# EAGLE design rda5708m (EAGLE 8.0.1)
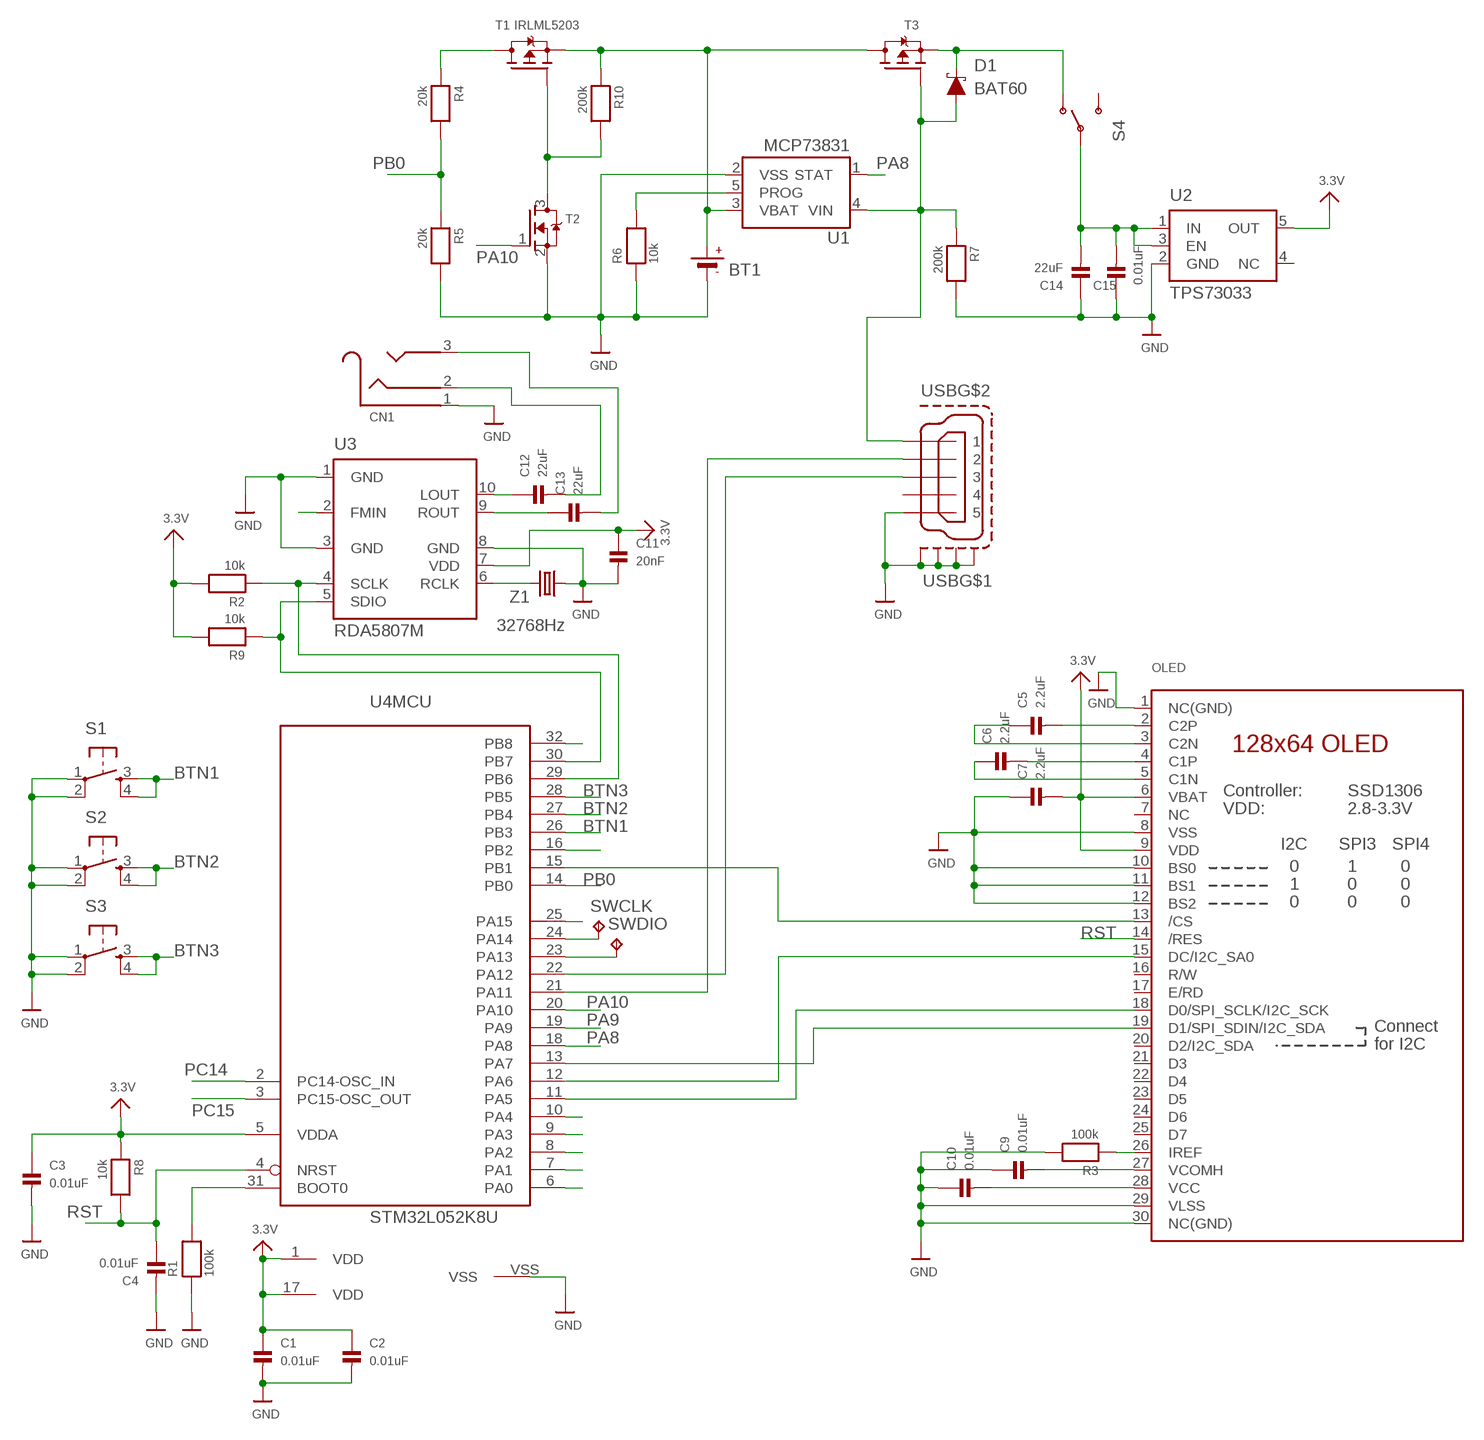
[diagram p0: schematic, sheet 1]

## Parts
BT1  LiPo 4.2V  BATTERY  [JSTPH2]
C1  0.01uF  CAP_CERAMIC0603  [0603]
C2  0.01uF  CAP_CERAMIC0603  [0603]
C3  0.01uF  CAP_CERAMIC0603  [0603]
C4  0.01uF  CAP_CERAMIC0603  [0603]
C5  2.2uF  CAP_CERAMIC0603  [0603]
C6  2.2uF  CAP_CERAMIC0603  [0603]
C7  2.2uF  CAP_CERAMIC0603  [0603]
C9  0.01uF  CAP_CERAMIC0603  [0603]
C10  0.01uF  CAP_CERAMIC0603  [0603]
C11  20nF  CAP_CERAMIC0603  [0603]
C12  22uF  CAP_CERAMIC0805  [0805]
C13  22uF  CAP_CERAMIC0805  [0805]
C14  22uF  CAP_CERAMIC0805  [0805]
C15  0.01uF  CAP_CERAMIC0603  [0603]
CN1  AUDIO_3.5JACK  [AUDIO_3.5]
D1  BAT60  DIODE-SCHOTTKY-BAT20J  [SOD-323]
OLED  DISP_OLED_UG-2864HSWEG012SIDE  [OLED0.96]
R1  100k  RESISTOR0603  [0603]
R2  10k  RESISTOR0603  [0603]
R3  100k  RESISTOR0603  [0603]
R4  20k  RESISTOR0603  [0603]
R5  20k  RESISTOR0603  [0603]
R6  10k  RESISTOR0603  [0603]
R7  200k  RESISTOR0603  [0603]
R8  10k  RESISTOR0603  [0603]
R9  10k  RESISTOR0603  [0603]
R10  200k  RESISTOR0603  [0603]
S1  TAC_SWITCH  [TACTILE-SWITCH-SMD45]
S2  TAC_SWITCH  [TACTILE-SWITCH-SMD45]
S3  TAC_SWITCH  [TACTILE-SWITCH-SMD45]
S4  SWITCH-SPDTPTH2  [SWITCH-DPDT]
SWCLK  TPTP10R  [TP10R]
SWDIO  TPTP10R  [TP10R]
T1  IRLML5203  MOSFET-P  [SOT23-R]
T2  MOSFET-NREFLOW  [SOT23-R]
T3  MOSFET-P  [SOT23-R]
U1  MCP73831  [SOT23-5]
U2  TPS73033  [SOT23-5]
U3  RDA5807M  [MSOP10]
U4  STM32L052K8U  [UFQFPN32]
USB  MICRO-USB-SHIELD-MICRO_USB-B_4.85_HORN  [MICRO_USB-B_4.85_HORN]
Z1  32768Hz  CRYSTAL  [TC26H-SMD]

## Nets
3.3V: C1.1 C2.1 C3.1 C7.2 C11.1 OLED.6(VBAT) OLED.9(VDD) R2.2 R8.1 R9.2 U2.5(OUT) U3.7(VDD) U4.1(PWR:VDD) U4.5(MCU:VDDA) U4.17(PWR:VDD)
+5V: C14.2 C15.2 S4.2(P) U2.1(IN) U2.3(EN)
ANT: U3.2(FMIN)
BOOT0: R1.2 U4.31(MCU:BOOT0)
BTN1: S1.3 S1.4 U4.26(MCU:PB3)
BTN2: S2.3 S2.4 U4.27(MCU:PB4)
BTN3: S3.3 S3.4 U4.28(MCU:PB5)
GND: BT1.1(-) C1.2 C2.2 C3.2 C4.2 C7.1 C9.1 C10.1 C11.2 C14.1 C15.1 CN1.1 OLED.1(NC(GND)) OLED.8(VSS) OLED.10(BS0) OLED.11(BS1) OLED.12(BS2) OLED.29(VLSS) OLED.30(NC(GND)) R1.1 R3.2 R5.2 R6.1 R7.2 S1.1 S1.2 S2.1 S2.2 S3.1 S3.2 T2.2(S) U1.2(VSS) U2.2(GND) U3.1(GND) U3.3(GND) U3.8(GND) U4.VSS(PWR:VSS) USB.5 USB.M1(S1) USB.M2(S2) USB.M3(S3) USB.M4(S4) Z1.P$1
N$1: U3.6(RCLK) Z1.P$2
N$2: R4.1 T1.3(D)
N$5: C12.1 U3.10(LOUT)
N$6: C5.2 OLED.2(C2P)
N$7: C5.1 OLED.3(C2N)
N$8: C6.2 OLED.4(C1P)
N$9: C6.1 OLED.5(C1N)
N$10: C13.1 U3.9(ROUT)
N$14: R6.2 U1.5(PROG)
N$15: D1.C S4.1(O) T3.2(S)
N$18: R10.2 T1.1(G) T2.3(D)
N$22: OLED.26(IREF) R3.1
N$23: C9.2 OLED.27(VCOMH)
N$24: C10.2 OLED.28(VCC)
N$25: C13.2 CN1.3
N$26: C12.2 CN1.2
PA0: U4.6(MCU:PA0)
PA1: U4.7(MCU:PA1)
PA2: U4.8(MCU:PA2)
PA3: U4.9(MCU:PA3)
PA4: U4.10(MCU:PA4)
PA8: U1.1(STAT) U4.18(MCU:PA8)
PA9: U4.19(MCU:PA9)
PA10: T2.1(G) U4.20(MCU:PA10)
PA11: U4.21(MCU:PA11) USB.2
PA12: U4.22(MCU:PA12) USB.3
PA15: U4.25(MCU:PA15)
PB0: R4.2 R5.1 U4.14(MCU:PB0)
PB1: OLED.13(/CS) U4.15(MCU:PB1)
PB2: U4.16(MCU:PB2)
PB8: U4.32(MCU:PB8)
PC14: U4.2(MCU:PC14-OSC_IN)
PC15: U4.3(MCU:PC15-OSC_OUT)
RST: C4.1 OLED.14(/RES) R8.2 U4.4(MCU:NRST)
SCLK: R2.1 U3.4(SCLK) U4.29(MCU:PB6)
SDIO: R9.1 U3.5(SDIO) U4.30(MCU:PB7)
SPI_DC: OLED.15(DC/I2C_SA0) U4.12(MCU:PA6)
SPI_MOSI: OLED.19(D1/SPI_SDIN/I2C_SDA) U4.13(MCU:PA7)
SPI_SCK: OLED.18(D0/SPI_SCLK/I2C_SCK) U4.11(MCU:PA5)
SWCLK: SWCLK.TP U4.24(MCU:PA14)
SWDIO: SWDIO.TP U4.23(MCU:PA13)
VBAT: BT1.2(+) R10.1 T1.2(S) T3.3(D) U1.3(VBAT)
VUSB: D1.A R7.1 T3.1(G) U1.4(VIN) USB.1
Unconnected: OLED.7(NC) OLED.16(R/W) OLED.17(E/RD) OLED.20(D2/I2C_SDA) OLED.21(D3) OLED.22(D4) OLED.23(D5) OLED.24(D6) OLED.25(D7) S4.3(S) U2.4(NC) USB.4

## Library data of the parts
BT1 = rda5807m:BATTERY: CR1220 SMT - Digikey: 3001K-ND
C1-C7 C9-C15 = microbuilder:CAP_CERAMIC: Ceramic Capacitors 0402 - 0402 Surface Mount Capacitors 16pF 50V 5% [Digikey: 445-4899-2-ND] 18pF 50V 5% [Digikey: 490-1281-2-ND] 22pF 50V 5% [Digikey: 490-1283-2-ND] 68pF 50V 5% [Digikey: 490-1289-2-ND] 0.1uF 10V 10% [Digikey: 490-1318-2-ND] 1.0uF 6.3V 10% [Digikey: 490-1320-2-ND] 0603 - 0603 Surface Mount Capacitors 16 pF 50V 5% [Digikey: 445-5051-2-ND] 22 pF 50V [Digikey: PCC220ACVTR-ND] 33 pF 50V 5% [Digikey: 490-1415-1-ND] 56pF 50V 5% [Digikey: 490-1421-1-ND] 220pF 50V 5% [Digikey: 445-1285-1-ND] 680 pF 50V 2200 pF 50V 5% C0G [Digikey: 445-1297-1-ND] 5600 pF 100V 5% X7R [Digikey: 478-3711-1-ND] 0.1 µF 25V 10% [Digikey: PCC2277TR-ND] 0.22 µF 16V 10% X7R [Digikey: 445-1318-1-ND] 1.0 µF 25V 10% [Digikey: 445-5146-2-ND] 0603 - RF Specific 3pF 250V +/-0.1pF RF [Digikey: 712-1347-1-ND] 18 pF 250V 5% [Digikey: 478-3505-1-ND or 712-1322-1-ND] 56 pF 250V 5% C0G RF [Digikey: 490-4867-1-ND] 68 pF 250V RF [Digikey: 490-4868-1-ND] 0805 - 0805 Surface Mount Capacitors 220 pF 250V 2% RF Ceramic Capacitor [Digikey: 712-1398-1-ND] 1000 pF 50V 2% NP0 Ceramic Capacitor [Digikey: 478-3760-1-ND] 0.1 µF 25V 10% Ceramic Capacitor [Digikey: PCC1828TR-ND] 1.0 µF 16V 10% Ceramic Capacitor[Digikey: 490-1691-2-ND] 10.0 µF 10V 10% Ceramic Capacitor[Digikey: 709-1228-1-ND] 10.0 uF 16V 10% Ceramic Capacitor [Digikey: 478-5165-2-ND] 47 uF 6.3V 20% Ceramic Capacitor [Digikey: 587-1779-1-ND or 399-5506-1-ND] 1206 - 1206 Surface Mount Capacitors 47uF 10V 20% Ceramic Capacitor [Digikey: 490-5528-1-ND or 399-5508-1-ND or 445-6010-1-ND] 100uF 6.3V -20%, +80% Y5V Ceramic Capacitor (Digikey: 490-4512-1-ND, Mouser: 81-GRM31CF50J107ZE1L)
CN1 = rda5807m:AUDIO_3.5JACK: 3.5MM Audio Jack These are normally connected as follows, from left-to right on the schematic symbol above: Tip: Left Audio Inner Ring: Right Audio Shell: Common/GND
D1 = SparkFun-DiscreteSemi:DIODE-SCHOTTKY: Schottky diode A Schottky diode is a semiconductor diode which has a low forward voltage drop and a very fast switching action.; PROD_ID: DIO-11623; VALUE: 1A/23V/620mV
OLED = rda5807m:DISP_OLED_UG-2864HSWEG01: UG-2864HSWEG01 OLED display Both 1.3" and 0.96" models share the same FPC tab footprint, only the screen dimensions vary.
R1-R10 = microbuilder:RESISTOR: Resistors 0402 - 0402 Surface Mount Package 22 Ohm 1% 1/16W [Digikey: 311-22.0LRTR-ND] 33 Ohm 5% 1/16W 1.0K 5% 1/16W 1.5K 5% 1/16W 2.0K 1% 1/16W 10.0K 1% 1/16W [Digikey: 311-10.0KLRTR-ND] 10.0K 5% 1/16W [Digikey: RMCF0402JT10K0TR-ND] 12.1K 1% 1/16W [Digikey: 311-22.0LRTR-ND] 100.0K 5% 1/16W 0603 - 0603 Surface Mount Package 0 Ohm 1/10 Watt 1% Resistor 15 Ohm 1/10 Watt 1% Resistor 33 Ohm 1/10 Watt 1% Resistor 49.9 Ohm 1/10 Watt 1% Resistor 100 Ohm 1/10 Watt 1% Resistor 150 Ohm 1/10 Watt 1% Resistor 240 Ohm 1/10 Watt 1% Resistor 390 Ohm 1/10 Watt 1% Resistor 560 Ohm 1/10 Watt 1% Resistor 680 Ohm 1/10 Watt 1% Resistor 750 Ohm 1/10 Watt 1% Resistor 1.0K Ohm 1/10 Watt 1% Resistor 1.5K Ohm 1/10 Watt 1% Resistor 2.0K Ohm 1/10 Watt 1% Resistor 2.2K Ohm 1/10 Watt 1% Resistor 3.3K Ohm 1/10 Watt 1% Resistor 4.7K Ohm 1/10 Watt 1% Resistor 10.0K Ohm 1/10 Watt 1% Resistor 12.0K Ohm 1/10 Watt 1% Resistor 12.1K Ohm 1/10 Watt 1% Resistor 20.0K Ohm 1/10 Watt 1% Resistor 33.0K Ohm 1/10 Watt 1% Resistor 100.0K Ohm 1/10 Watt 1% Resistor 0805 - 0805 Surface Mount Package 0 Ohm 1/8 Watt 1% Resistor 33 Ohm 1/8 Watt 1% Resistor 100 Ohm 1/8 Watt 1% Resistor 150 Ohm 1/8 Watt 1% Resistor 200 Ohm 1/8 Watt 1% Resistor 240 Ohm 1/8 Watt 1% Resistor 330 Ohm 1/8 Watt 1% Resistor 390 Ohm 1/8 Watt 1% Resistor 470 Ohm 1/8 Watt 1% Resistor 1.0K Ohm 1/8 Watt 1% Resistor 1.5K Ohm 1/8 Watt 1% Resistor 2.0K Ohm 1/8 Watt 1% Resistor 4.7K Ohm 1/8 Watt 1% Resistor 5.1K Ohm 1/8 Watt 1% Resistor 5.6K Ohm 1/8 Watt 1% Resistor 10.0K Ohm 1/8 Watt 1% Resistor 22.0K Ohm 1/8 Watt 1% Resistor 33.0K Ohm 1/8 Watt 1% Resistor 100K Ohm 1/8 Watt 1% Resistor 1206 - 1206 Surface Mount Package 2012 - 2010 Surface Mount Package 0.11 Ohm 1/2 Watt 1% Resistor - Digikey: RHM.11UCT-ND
S1-S3 = rda5807m:TAC_SWITCH: Momentary Switch Button commonly used for reset or general input. Spark Fun Electronics SKU : COM-00097 SMT- SWCH-08247
S4 = rda5807m:SWITCH-SPDT: SPDT Switch Simple slide switch, Spark Fun Electronics SKU : COM-00102 DPDT SMT slide switch, AYZ0202, SWCH-08179
SWCLK SWDIO = testpad:TP: Test pad
T1 T3 = microbuilder:MOSFET-P: P-Channel Mosfet LEGEND VDS: Voltage Drain-Source ID: Drain Current RDS(ON): Drain-Source On-State Resistance VGS(TH): Gate-Source Threshold Voltage CISS: Drain-Source Input Capacitance SOT-23 Name VDS ID RDS(ON) VGS(TH) CISS Order Number IRLML5103 30V 760mA 600 mOhm -- 75pF @ 25V Digikey: IRLML5103PBFCT-ND IRLML6401 12V 4.3A 50 mOhm 950mV @ 250µA 830pF @ 10V Digikey: IRLML6401PBFTR-ND NTR0202PL 20V 400mA 800 mOhm 2.3V @ 250uA 70pF @ 5V Digikey: NTR0202PLT1GOSTR-ND NTR4101PT1G 20V 1.8A 85 mOhm 1.2V @ 250uA 675pF @ 10V Digikey: NTR4101PT1GOSCT-ND DMP2004K 20V 600mA 900 mOhm 1V @ 250uA 175pF @ 16V Digikey: DMP2004KDICT-ND PMV65XP 20V 3.9A 76 mOhm 950mV @ 1mA 725pF @ 20V Digikey: 568-2358-2-ND TO-252 Name VDS ID RDS(ON) VGS(TH) CISS Order Number AOD417 30V 25A 34 mOhm 3V @ 250µA 920pF @ 15V Digikey: 785-1106-2-ND
T2 = microbuilder:MOSFET-N: N-Channel Mosfet LEGEND VDS: Voltage Drain-Source ID: Drain Current RDS(ON): Drain-Source On-State Resistance VGS(TH): Gate-Source Threshold Voltage CISS: Drain-Source Input Capacitance SOT-23 Name VDS ID RDS(ON) VGS(TH) CISS Order Number 2N7002E 60V 260mA 2.5 Ohm 2.5V @ 250uA 26.7pF @ 25V 2N7002ET1GOSTR-ND BSH103 30V 850mA 400 mOhm 400mV @ 1mA 83pF @ 24V BSH103,235-ND BSS138 60V 320mA 1.6 Ohm 1.5V @ 250uA 50pF @ 10V Mouser: 771-BSS138PW115 DMN2075U-7 20V 4.2A 38 mOhm 1V @ 250 uA 594.3pF @ 10V DMN2075U-7DICT-ND * BSS138 good choice for I2C level-shifting
U1 = rda5807m:MCP73831: MCP73831T Li-Ion, Li-Pol Controller Miniature single cell, fully integrated Li-Ion, Li-polymer charge management controller Datasheet <http://ww1.microchip.com/downloads/en/DeviceDoc/20001984g.pdf> SparkFun Products: SparkFun ESP32 Thing <https://www.sparkfun.com/products/13907> SparkFun 9DoF Razor IMU M0 <https://www.sparkfun.com/products/14001>; PROD_ID: IC-09995
U2 = X893:TPS73033: LOW-NOISE, HIGH PSRR, RF 200-mA LOW-DROPOUT LINEAR REGULATOR http://www.terraelectronica.ru/pdf/TI/TPS73033.pdf
U3 = rda5807m:RDA5807M: SINGLE-CHIP BROADCAST FM RADIO TUNER with I2C Interface 10-Lead MSOP; MPN: RDA5807M; OC_FARNELL: 1078311; OC_NEWARK: 31M4422
U4 = micro-stm_v3:STM32L052K*U: ARM 32-bit Cortex™-M0+ CPU 32 MHz maximum frequency 32 to 64 Kbytes of Flash memory 2 kbyte of Data EEPROM 8 kbytes of SRAM 27 GPIOs 1.8 to 3.6 V application supply
USB = rda5807m:MICRO-USB-SHIELD-: Hirose Micro USB Connector ZX62R-B-5P: Micro B, reverse (top mount) shell SMT Supplier: DigiKey H11574CT-ND Source: http://www.hirose.co.jp/cataloge_hp/e24200011.pdf
Z1 = rda5807m:CRYSTAL: CRYSTAL

## Board
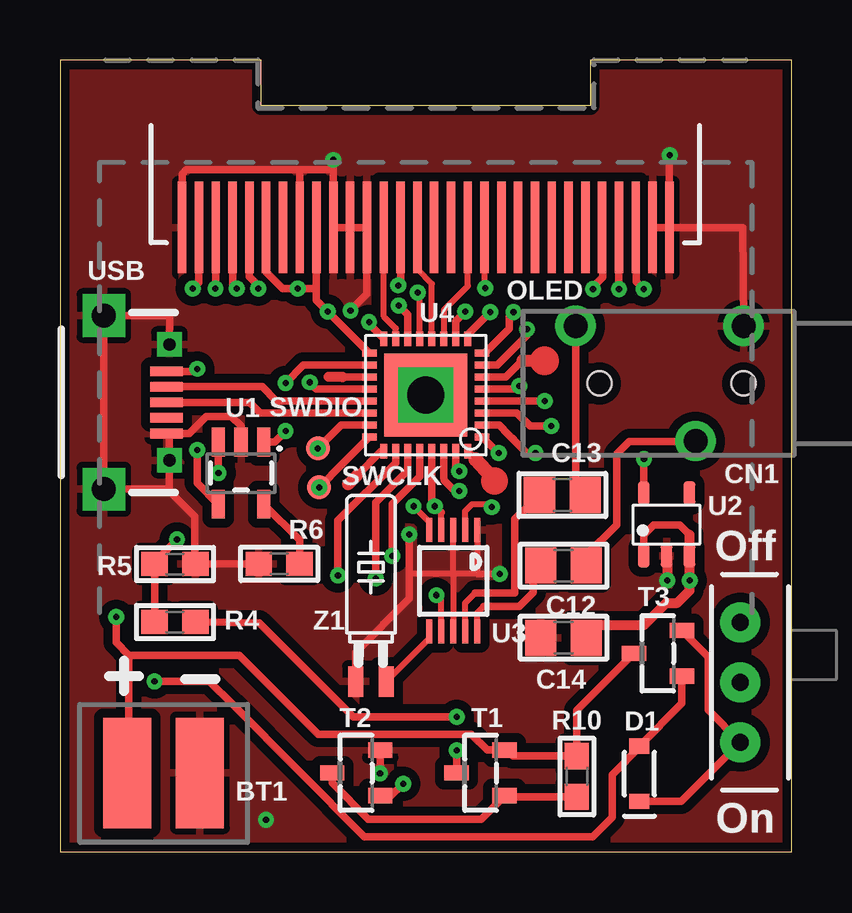
[diagram p1: board, top side]
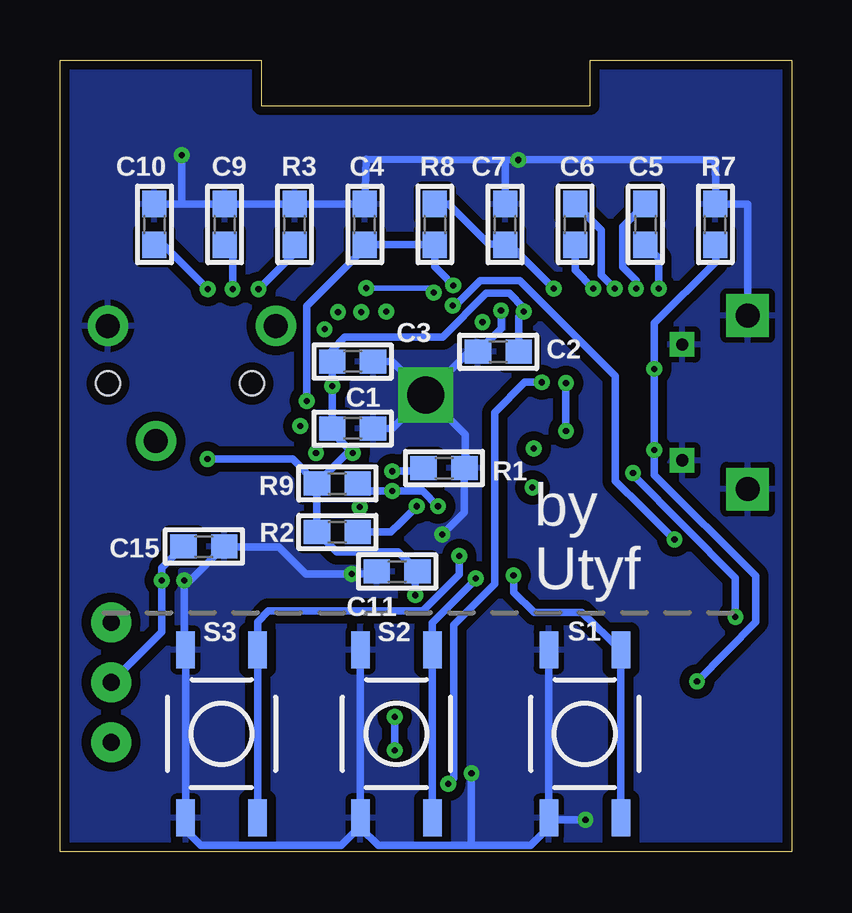
[diagram p2: board, bottom side, seen from below]

Size 30.48 x 33.02 mm. Coordinates in mm from the lower left corner, seen from the top.
Outline: 0,0 30.48,0 30.48,33.02 22.1,33.02 22.1,31.11 8.38,31.11 8.38,33.02 0,33.02 0,0
Copper layers (1*16): Top 0.035mm / dielectric 1.5mm / Bottom 0.035mm
Design rules "default *": minimum track width 8mil, minimum drill 10mil, track to track 5mil, track to pad 5mil, pad to pad 5mil, via to via 5mil, smd to smd 5mil, copper to edge 5mil, drill to drill 5mil, minimum pad ring 10mil, minimum via ring 8mil, stop-mask expansion 4mil, vias tented up to drill 0mil, thermal gap 10mil

### Footprints (pad centres in the part's own frame; a part is rotated, then mirrored left to right if it is on the bottom)
JSTPH2 = smd 2 x 4.6: 1 -1.508,-3.7; 2 1.508,-3.7
0603 = smd 1.1 x 1: 1 -0.85,0; 2 0.85,0
0805 = smd 1.3 x 1.5: 1 -0.95,0; 2 0.95,0
AUDIO_3.5 = drill 1 pad 1.676: 1 2.1,-2.4; 2 4.1,2.4; 3 9.1,-2.4 | hole 1: 2.1,0; 8.1,0
SOD-323 = smd 0.63 x 0.83: A 1.15,0; C -1.15,0
OLED0.96 = smd 0.35 x 3.81: 1 10.15,-0.635; 2 9.45,-0.635; 3 8.75,-0.635; 4 8.05,-0.635; 5 7.35,-0.635; 6 6.65,-0.635; 7 5.95,-0.635; 8 5.25,-0.635; 9 4.55,-0.635; 10 3.85,-0.635; 11 3.15,-0.635; 12 2.45,-0.635; 13 1.75,-0.635; 14 1.05,-0.635; 15 0.35,-0.635; 16 -0.35,-0.635; 17 -1.05,-0.635; 18 -1.75,-0.635; 19 -2.45,-0.635; 20 -3.15,-0.635; 21 -3.85,-0.635; 22 -4.55,-0.635; 23 -5.25,-0.635; 24 -5.95,-0.635; 25 -6.65,-0.635; 26 -7.35,-0.635; 27 -8.05,-0.635; 28 -8.75,-0.635; 29 -9.45,-0.635; 30 -10.15,-0.635
TACTILE-SWITCH-SMD45 = smd 1.524 x 0.762: 1 -3.5,1.5; 2 3.5,1.5; 3 -3.5,-1.5; 4 3.5,-1.5
SWITCH-DPDT = drill 0.7 pad 1.676: 1 -2.5,0; 2 0,0; 3 2.5,0
TP10R = smd 1 x 1: TP 0,0
SOT23-R = smd 0.635 x 1.016: 1 -0.95,-1; 2 0.95,-1; 3 0,1
SOT23-5 = smd 0.55 x 1.2: 1 -0.95,-1.3; 2 0,-1.3; 3 0.95,-1.3; 4 0.95,1.3; 5 -0.95,1.3
SOT23-5' = smd 0.5 x 1: 1 -0.95,-1.3; 2 0,-1.3; 3 0.95,-1.3; 4 0.95,1.3; 5 -0.95,1.3
MSOP10 = smd 0.25 x 1: 1 -1,-2.113; 2 -0.5,-2.113; 3 0,-2.113; 4 0.5,-2.113; 5 1,-2.113; 6 1,2.113; 7 0.5,2.113; 8 0,2.113; 9 -0.5,2.113; 10 -1,2.113
UFQFPN32 = smd 0.6 x 0.3: 1 -2.35,1.75; 2 -2.35,1.25; 3 -2.35,0.75; 4 -2.35,0.25; 5 -2.35,-0.25; 6 -2.35,-0.75; 7 -2.35,-1.25; 8 -2.35,-1.75; 17 2.35,-1.75; 18 2.35,-1.25; 19 2.35,-0.75; 20 2.35,-0.25; 21 2.35,0.25; 22 2.35,0.75; 23 2.35,1.25; 24 2.35,1.75 | smd 0.3 x 0.6: 9 -1.75,-2.35; 10 -1.25,-2.35; 11 -0.75,-2.35; 12 -0.25,-2.35; 13 0.25,-2.35; 14 0.75,-2.35; 15 1.25,-2.35; 16 1.75,-2.35; 25 1.75,2.35; 26 1.25,2.35; 27 0.75,2.35; 28 0.25,2.35; 29 -0.25,2.35; 30 -0.75,2.35; 31 -1.25,2.35; 32 -1.75,2.35 | smd 3.45 x 3.45: VSS 0,0
MICRO_USB-B_4.85_HORN = smd 1.35 x 0.4: 1 2.993,1.3; 2 2.993,0.65; 3 2.993,0; 4 2.993,-0.65; 5 2.993,-1.3 | drill 1 pad 1.778 square: M1 0.381,-3.619; M2 0.381,3.619 | drill 0.508 pad 1.016 square: M3 3.111,2.413; M4 3.111,-2.413
TC26H-SMD = smd 0.635 x 1.27: P$1 -0.635,0; P$2 0.635,0

### Placement (x,y rotation side)
BT1  4.32,-0.41 180 top
C1  18.29,17.65 0 bottom
C2  12.22,20.85 180 bottom
C3  18.29,20.45 0 bottom
C4  17.78,26.16 90 bottom
C5  6.1,26.16 270 bottom
C6  9.02,26.16 90 bottom
C7  11.94,26.16 270 bottom
C9  23.62,26.16 270 bottom
C10  26.54,26.16 270 bottom
C11  16.43,11.7 180 bottom
C12  20.98,11.94 0 top
C13  20.93,14.88 0 top
C14  20.98,8.93 0 top
C15  24.49,12.74 180 bottom
CN1  30.58,19.53 180 top
D1  24.14,3.26 90 top
OLED  15.24,25.4 180 top
R1  14.48,16 180 bottom
R2  18.92,13.34 180 bottom
R3  20.7,26.16 90 bottom
R4  4.79,9.59 180 top
R5  4.79,12 0 top
R6  9.13,12.01 0 top
R7  3.17,26.16 90 bottom
R8  14.86,26.16 270 bottom
R9  18.92,15.37 180 bottom
R10  21.54,3.15 270 top
S1  8.61,4.93 90 bottom
S2  16.46,4.93 90 bottom
S3  23.75,4.93 90 bottom
S4  28.35,7.07 90 top
SWCLK  10.79,15.2 0 top
SWDIO  10.74,16.83 0 top
T1  17.53,3.3 90 top
T2  12.34,3.3 90 top
T3  24.91,8.29 90 top
U1  7.54,15.8 180 top
U2  TPS73033  [SOT23-5']  25.27,13.65 0 top
U3  16.38,11.3 180 top
U4  15.24,19.05 180 top
USB  1.45,18.75 0 top
Z1  12.95,7.11 0 top

### Tracks (layer width: path | path; a pad name or v marks a point on that pad's centre or on a via)
3.3V  (via drill 0.25)
  Top 0.254: U3.7 15.88,10.51 v15.68,10.71 | v24.32,16.37 v24.33,16.38
  Top 0.305: U4.5 18.98,19.3 v19.14,19.43 | v18.29,16.64 18.25,16.64 U4.1 | U4.17 11.79,21.89 v11.15,22.53 10.67,23.01 10.67,23.47 | OLED.6 8.59,24.18 9.27,23.5 v9.91,23.5 10.54,23.5 10.67,23.47 | OLED.9 10.67,26.01 10.67,23.47 | U2.5 v24.32,16.37
  Bottom 0.305: C1.1 19.14,17.49 v18.29,16.64 18.5,16.64 R9.2 | C2.1 11.37,22.32 v11.15,22.53 11.15,22.68 11.76,23.29 12.71,23.29 14.53,21.46 18.61,21.46 19.14,20.93 C3.1 v19.14,19.43 19.14,17.78 | v9.91,23.5 11.63,25.22 C7.2 11.97,25.35 12.62,25.35 14.29,27.01 R8.1 | 19.14,17.78 C1.1 | R9.2 R2.2 18.95,12.51 16.38,12.51 15.75,11.87 15.75,11.58 C11.1 15.68,11.21 v15.68,10.71 | v24.33,16.38 20.79,16.38 R9.2 | C1.1 19.14,17.78 | C1.1 19.14,17.78 | C1.1 19.14,17.78 | C1.1 19.14,17.78
+5V  (via drill 0.25)
  Top 0.305: U2.1 24.32,13.22 24.74,13.64 25.83,13.64 26.22,13.25 U2.3 26.24,12.34
  Top 0.406: 26.24,12.34 v26.24,11.33 26.24,10.9 25.73,10.39 25.26,10.39 24.35,9.47 22.48,9.47 C14.2 | 26.22,13.24 U2.3
  Bottom 0.254: C15.2 25.42,12.82
  Bottom 0.305: C15.2 26.24,11.84 v26.24,11.33 26.24,9.18 S4.2
ANT  (via drill 0.25)
  Top 0.254: U3.2 16.88,14.22 17.17,14.5 17.86,14.5 v17.98,14.38
BOOT0  (via drill 0.25)
  Top 0.305: U4.31 16.49,15.89 v16.64,15.88
  Bottom 0.305: v16.64,15.88 15.46,15.88 R1.2
BTN1  (via drill 0.25)
  Top 0.305: v11.58,11.53 11.58,13.82 13.99,16.23 U4.26
  Bottom 0.305: S1.3 S1.4 8.74,9.98 10.72,9.98 11.58,10.82 v11.58,11.53
BTN2  (via drill 0.25)
  Top 0.305: U4.27 14.49,15.91 13.16,14.58 v13.16,11.4
  Bottom 0.305: S2.3 S2.4 14.96,9.55 13.26,11.25 v13.16,11.4
BTN3  (via drill 0.25)
  Top 0.305: U4.28 14.99,15.65 13.84,14.5 v13.84,12.34
  Bottom 0.305: S3.3 S3.4 22.25,9.6 21.79,10.06 15.37,10.06 13.84,11.58 v13.84,12.34
GND  (via drill 0.25, 1.52)
  Top 0.254: 16.38,11.61 U3.3 | 16.38,11.61 U3.8 | U3.1 17.38,11.59 v18.33,11.6 16.38,11.6 | 14.55,11.61 16.38,11.61
  Top 0.305: v11.38,28.85 11.38,28.45 | 9.99,28.45 OLED.8 | 11.38,28.45 11.39,28.36 OLED.10 OLED.11 OLED.12 12.79,23.25 v12.1,22.57 | 11.38,28.45 9.99,28.45 | OLED.1 5.09,28.27 5.27,28.45 9.99,28.45 | v25.4,29.06 25.39,28.44 OLED.30 | OLED.30 OLED.29 | CN1.1 28.45,26.03 OLED.30 | USB.M3 4.57,22.36 USB.M2 USB.M1 4.56,15.13 | U2.2 25.3,12.33 | Z1.P$1 12.32,8.33 14.55,10.57 14.55,11.61 v14.55,13.23 | U1.2 7.54,17.75 7.14,18.16 6.1,18.16 5.38,17.45 USB.5 4.56,17.33 USB.M4 4.56,15.13 | R6.1 R5.2 5.61,12.03 5.61,13.99 4.56,15.05 4.56,15.13 | BT1.1 5.83,2.15 | T2.2 v13.34,3.29 v13.34,3.28
  Top 0.406: 25.3,12.33 v25.3,11.33 | C14.1 19.94,8.84
  Bottom 0.254: C15.1 23.62,12.72
  Bottom 0.305: 25.4,27.01 C9.1 R3.2 C4.2 17.73,28.88 11.92,28.85 | U4.VSS 13.59,17.4 13.59,16.51 13.37,16.3 R1.1 13.63,14.16 v14.55,13.23 | C3.2 16.64,20.45 U4.VSS | C1.2 16.64,17.65 U4.VSS | U4.VSS 13.46,20.83 C2.2 12.1,21.83 v12.1,22.57 | C10.1 25.4,27.01 | 25.4,27.01 v25.4,29.06 | C11.2 17.34,11.59 v18.33,11.6 20.23,11.6 21.36,12.72 23.62,12.72 | S1.1 S1.2 | S2.2 S2.1 | USB.M2 1.82,27.02 R7.2 3.16,27.52 3.18,28.86 v11.38,28.85 11.92,28.85 | C15.1 25.05,11.33 v25.3,11.33 25.3,8.48 S3.2 S3.1 25.25,0.92 24.61,0.28 18.77,0.28 18.16,0.89 18.16,1.23 S2.1 | S2.1 17.96,1.02 17.22,0.28 13.41,0.28 | 13.41,0.28 10.87,0.28 10.29,0.86 10.29,1.18 S1.1 | v8.59,1.35 10.11,1.35 S1.1 | v13.34,3.28 13.34,0.36 13.41,0.28 | C7.1 11.92,28.85
  other vias: 15.24,19.05
  pour Top (isolate 0.381): 0.18,32.79 8.13,32.79 8.13,30.73 22.45,30.73 22.45,32.72 30.23,32.72 30.23,0.28 0.25,0.28 0.2,0.28 0.18,0.28
  pour Bottom (isolate 0.381): 0.18,32.82 8.18,32.82 8.18,30.91 22.33,30.91 22.33,32.82 30.3,32.82 30.28,-0.13 0.18,-0.15
N$1
  Top 0.254: U3.6 15.38,8.91 Z1.P$2
N$2  (via drill 0.25)
  Top 0.305: R4.1 8.31,9.55 12.22,5.64 v16.54,5.64 | v16.54,4.24 16.54,3.39 T1.3
  Bottom 0.305: v16.54,5.64 v16.54,4.24
N$5
  Top 0.254: U3.10 17.38,9.97 17.65,10.24
  Top 0.305: 17.65,10.24 19.13,10.24 19.72,10.82 19.72,11.84 C12.1
N$6  (via drill 0.25)
  Top 0.305: OLED.2 5.79,23.75 v5.54,23.5
  Bottom 0.305: C5.2 5.54,24.75 v5.54,23.5
N$7  (via drill 0.25)
  Top 0.305: OLED.3 v6.49,23.51 v6.48,23.5
  Bottom 0.305: v6.48,23.5 6.48,23.82 7.04,24.38 7.04,26.07 C5.1
N$8  (via drill 0.25)
  Top 0.305: OLED.4 7.19,23.67 v7.37,23.5
  Bottom 0.305: C6.2 7.92,25.92 7.92,24.05 v7.37,23.5
N$9  (via drill 0.25)
  Top 0.305: v8.26,23.5 8.26,23.62 7.89,23.99 OLED.5
  Bottom 0.305: v8.26,23.5 9.02,24.26 C6.1
N$10
  Top 0.254: U3.9 16.88,10.38 17.3,10.79
  Top 0.305: 17.3,10.79 18.95,10.79 18.95,13.89 C13.1
N$14
  Top 0.305: U1.5 9.98,13.01 R6.2
N$15
  Top 0.305: T3.2 27,8.14 27,7.49 27,5.93 S4.1 25.89,2.11 D1.C
N$18
  Top 0.305: R10.2 18.66,2.3 T1.1 17.55,1.37 12.85,1.37 11.34,2.88 T2.3
N$22  (via drill 0.25)
  Top 0.305: v22.21,23.47 22.21,23.58 22.61,23.98 OLED.26
  Bottom 0.305: R3.1 20.7,24.97 v22.21,23.47
N$23  (via drill 0.25)
  Top 0.305: OLED.27 v23.29,23.47
  Bottom 0.305: C9.2 23.67,25.18 23.29,24.84 v23.29,23.47
N$24  (via drill 0.25)
  Top 0.305: v24.32,23.47 24,23.79 24,25.53 OLED.28
  Bottom 0.305: C10.2 26.16,25.31 v24.32,23.47
N$25
  Top 0.305: CN1.3 21.48,15.59 C13.2
N$26
  Top 0.254: C12.2 21.93,12.38 | 26.16,17.12 CN1.2
  Top 0.305: 21.93,12.38 23.19,13.64 23.19,16.59 23.72,17.12 26.16,17.12
PA0
  Top 0.305: U4.6 18.58,19.8 19.07,20.3 | 19.28,20.5 19.07,20.3 | 19.07,20.3 19.28,20.5 | 19.07,20.3 19.28,20.5
  Top 0.508: 19.28,20.5 20.22,20.5
PA1  (via drill 0.25)
  Top 0.305: U4.7 18.22,20.3 19.46,21.54 v19.46,21.79
PA2  (via drill 0.25)
  Top 0.305: U4.8 17.7,20.8 18.72,21.82 18.72,22.33 v18.9,22.5
PA3  (via drill 0.25)
  Top 0.305: U4.9 16.99,21.56 v17.93,22.5
PA4  (via drill 0.25)
  Top 0.305: U4.10 16.49,22.13 v16.89,22.53
PA8  (via drill 0.25)
  Top 0.305: U4.18 10.14,20.3 v9.4,19.56 | v9.4,17.55 8.95,17.1 U1.1
  Bottom 0.305: v9.4,19.56 v9.4,17.55
PA9
  Top 0.305: U4.19 11.77,19.8
  Top 0.406: 11.77,19.8 11.19,19.8
PA10  (via drill 0.25)
  Top 0.305: U4.20 10.69,19.3 v10.4,19.58 | v14.3,2.85 13.77,2.32 T2.1
  Bottom 0.305: v10.4,19.58 11.12,19.58 12.36,18.33 12.37,11.18 14.07,9.47 14.07,3.07 v14.3,2.85
PA11
  Top 0.305: 4.46,19.38 USB.2 8.42,19.39 9.01,18.8 U4.21
PA12
  Top 0.305: U4.22 8.35,18.3 7.9,18.75 USB.3
PA15
  Top 0.305: U4.25 13.37,16.7 12.38,15.71
  Top 0.406: 12.38,15.71 12.38,15.7
  Top 0.508: 12.38,15.7 12.01,15.33
PB0  (via drill 0.25)
  Top 0.305: U4.14 14.49,22.4 v14.12,22.78 | v4.88,13.03 3.99,12.14 R5.1 R4.2
  Bottom 0.305: v14.12,22.78 14,22.8 12.98,23.82 11.33,23.82 7.34,19.84 7.34,15.47 6.2,14.35 v4.88,13.03
PB1
  Top 0.254: U4.15 13.99,21.82 13.49,22.32 OLED.13
PB2  (via drill 0.25)
  Top 0.305: U4.16 12.88,22.01 v12.88,22.1
PB8
  Top 0.305: U4.32 17.32,16.37
  Top 0.61: 17.32,16.37 18.14,15.47
PC14  (via drill 0.25)
  Top 0.305: U4.2 18.29,17.8 18.68,17.41 | 18.68,17.41 18.9,17.2 | v19.81,16.64 19.46,16.64 18.68,17.41
PC15  (via drill 0.25)
  Top 0.305: U4.3 19.04,18.3 19.58,17.75 v20.47,17.75
RST  (via drill 0.25)
  Top 0.305: OLED.14 14.19,23.78 v14.1,23.62 | v20.19,18.8 19.18,18.8 U4.4
  Bottom 0.305: v20.19,18.8 20.19,22.76 18.85,24.12 18.82,24.13 17.78,25.17 C4.1 R8.2 14.86,24.4 14.59,24.13 v14.1,23.62
SCLK  (via drill 0.25)
  Top 0.254: U3.4 15.88,14.15
  Top 0.305: U4.29 15.49,14.67 v15.62,14.41 15.88,14.15
  Bottom 0.254: 16.7,13.34 16.29,13.75 16.7,13.34
  Bottom 0.305: R2.1 16.7,13.34 16.29,13.75 v15.62,14.41
SDIO  (via drill 0.25)
  Top 0.254: v14.73,14.41 15.37,13.78 15.38,13.7 U3.5
  Top 0.305: U4.30 15.99,15.63 16,15.49 16.45,15.05 v16.64,15.05
  Bottom 0.305: R9.1 17.76,15.05 v16.64,15.05 15.37,15.05 v14.73,14.41
SPI_DC
  Top 0.254: U4.12 15.49,23.69 14.89,24.3 OLED.15
SPI_MOSI  (via drill 0.25)
  Top 0.254: U4.13 14.99,23.19 v14.91,23.32 | v17.72,23.51 17.69,23.71 OLED.19
  Bottom 0.254: v14.91,23.32 15.07,23.5 v17.72,23.51
SPI_SCK
  Top 0.254: U4.11 16,21.41 16,22.61 16.99,23.59 OLED.18
SWCLK  (via drill 0.25)
  Top 0.305: SWCLK.TP 11.78,16.19 U4.24
  other vias: 10.79,15.2
SWDIO  (via drill 0.25)
  Top 0.305: U4.23 11.72,17.8 SWDIO.TP
  other vias: 10.74,16.83
VBAT  (via drill 0.25)
  Top 0.305: U1.3 6.6,17.09 v6.6,15.8 | T3.3 21.54,5.91 R10.1 18.86,4 T1.2 17.8,4.25 17.14,4.9 10.77,4.9 7.47,8.2 2.87,8.2 | 2.87,8.2 2.34,8.74 2.33,8.95 v2.34,9.8 | 2.87,8.2 2.87,3.35 BT1.2
  Bottom 0.305: v6.6,15.8 6.6,15.72 2.34,11.42 v2.34,9.8
VUSB  (via drill 0.25)
  Top 0.305: v5.71,20.14 5.51,20.04 4.49,20.04 USB.1 | 6.58,14.51 U1.4 5.71,15.38 v5.71,16.76 | T3.1 25.91,6.19 D1.A 24.14,4.36 23.01,3.23 23.01,1.45 22.2,0.64 12.68,0.64 7.19,6.15 6.22,7.11 v3.94,7.11
  Bottom 0.305: R7.1 3.16,24.6 5.71,22.05 v5.71,20.14 v5.71,16.76 5.71,15.72 1.49,11.51 1.49,9.59 v3.94,7.11
(copper drawn outside any net)
  shapes: Top circle x2

### Text on the board
tPlace: Off | On
bPlace: by / Utyf